# Altium schematic sheet 低频超声第二版a.SchDoc
size A1
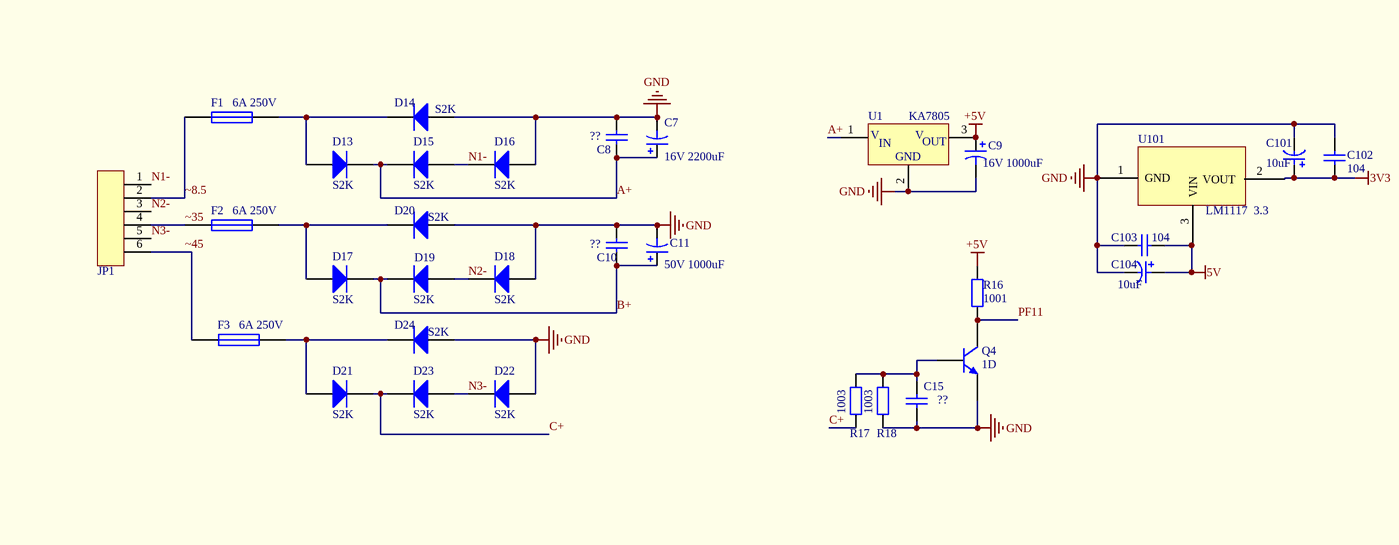
[diagram p0: 低频超声第二版a.SchDoc, top left]
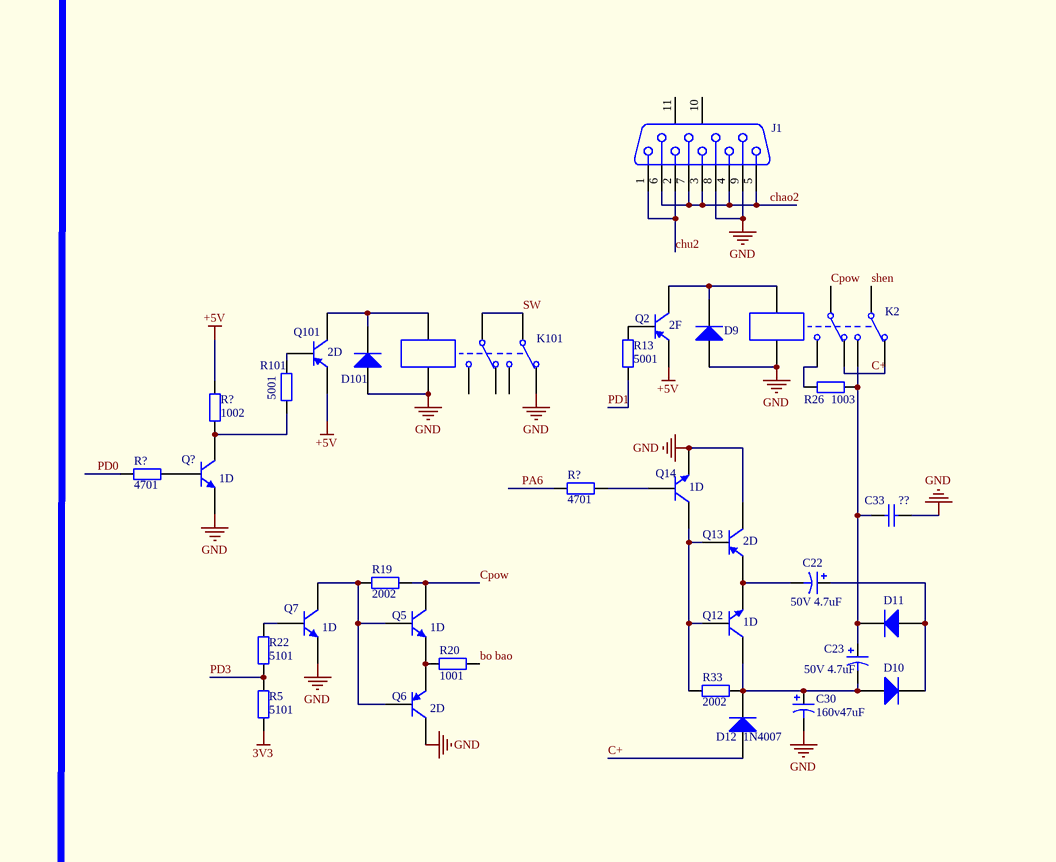
[diagram p1: 低频超声第二版a.SchDoc, top middle]
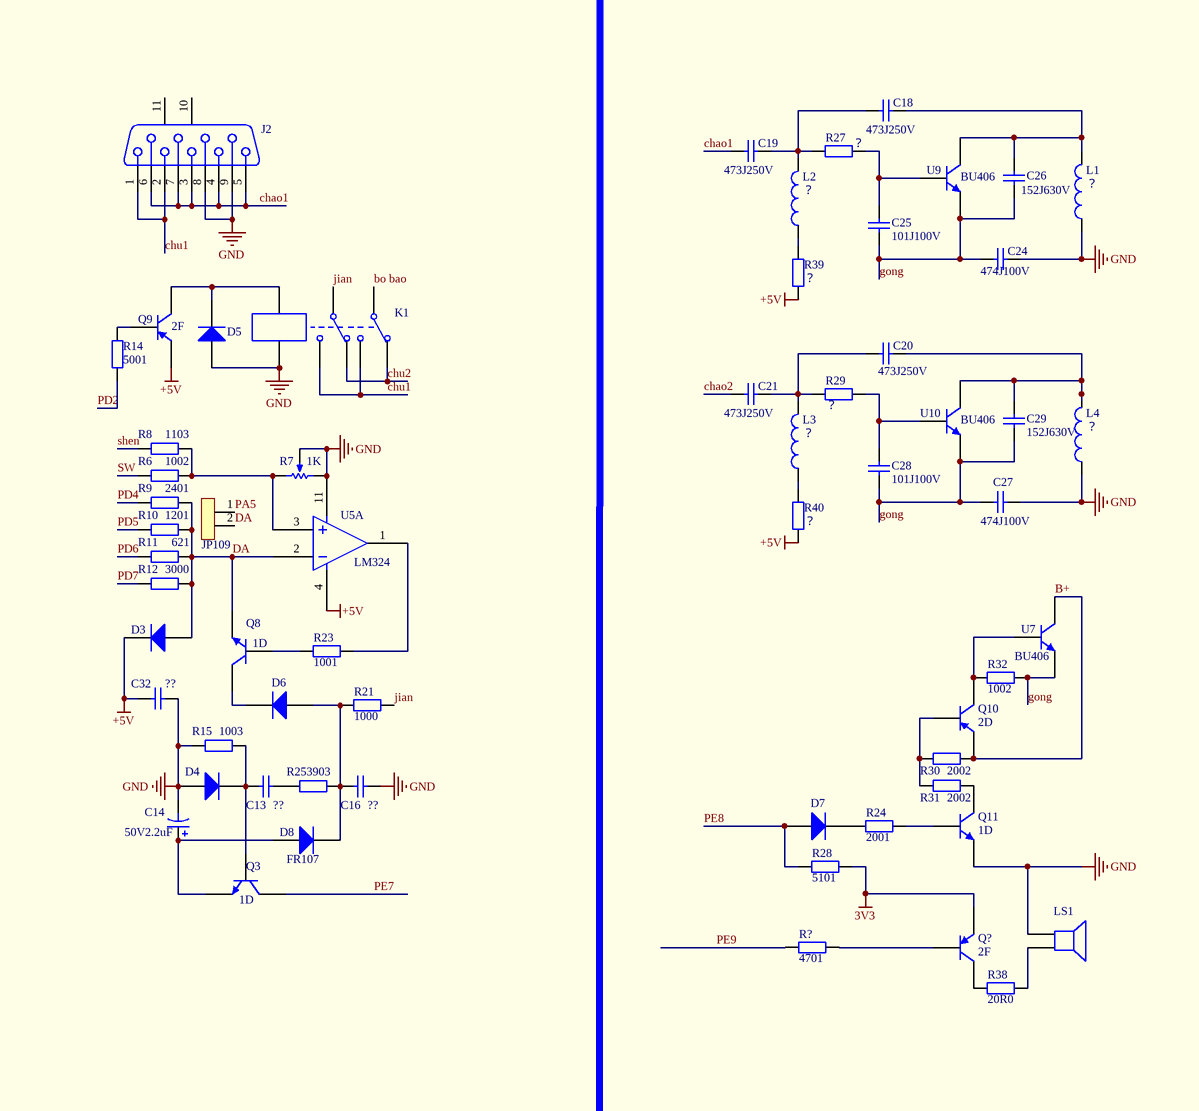
[diagram p2: 低频超声第二版a.SchDoc, top right]
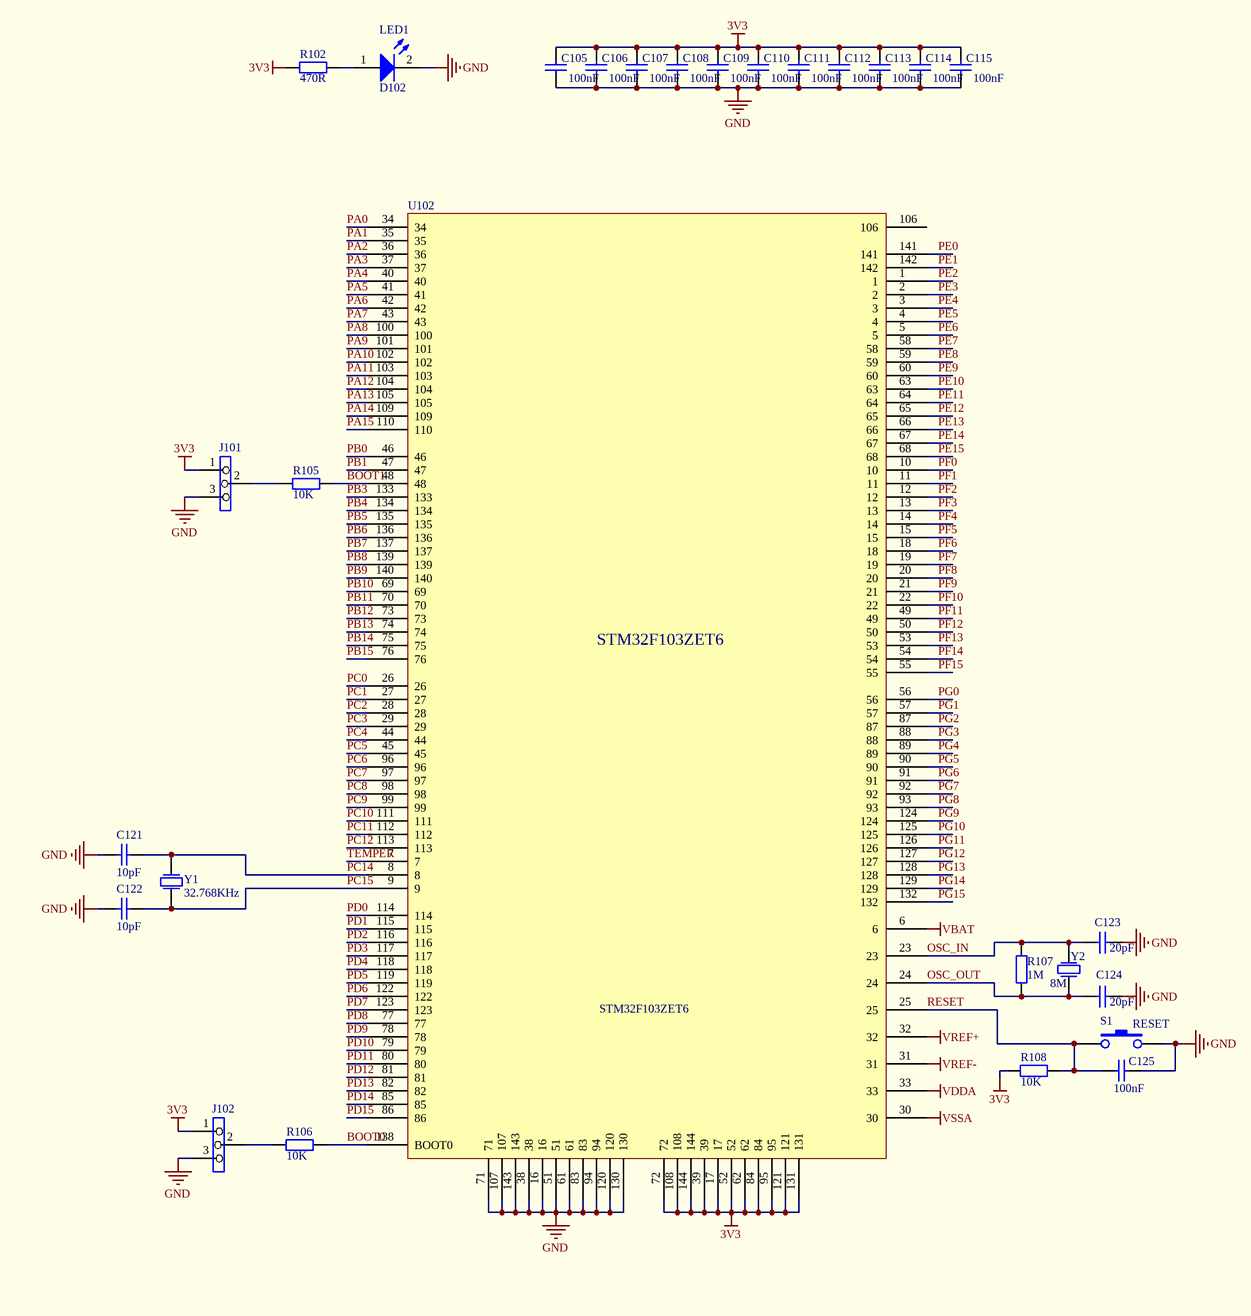
[diagram p3: 低频超声第二版a.SchDoc, bottom left]
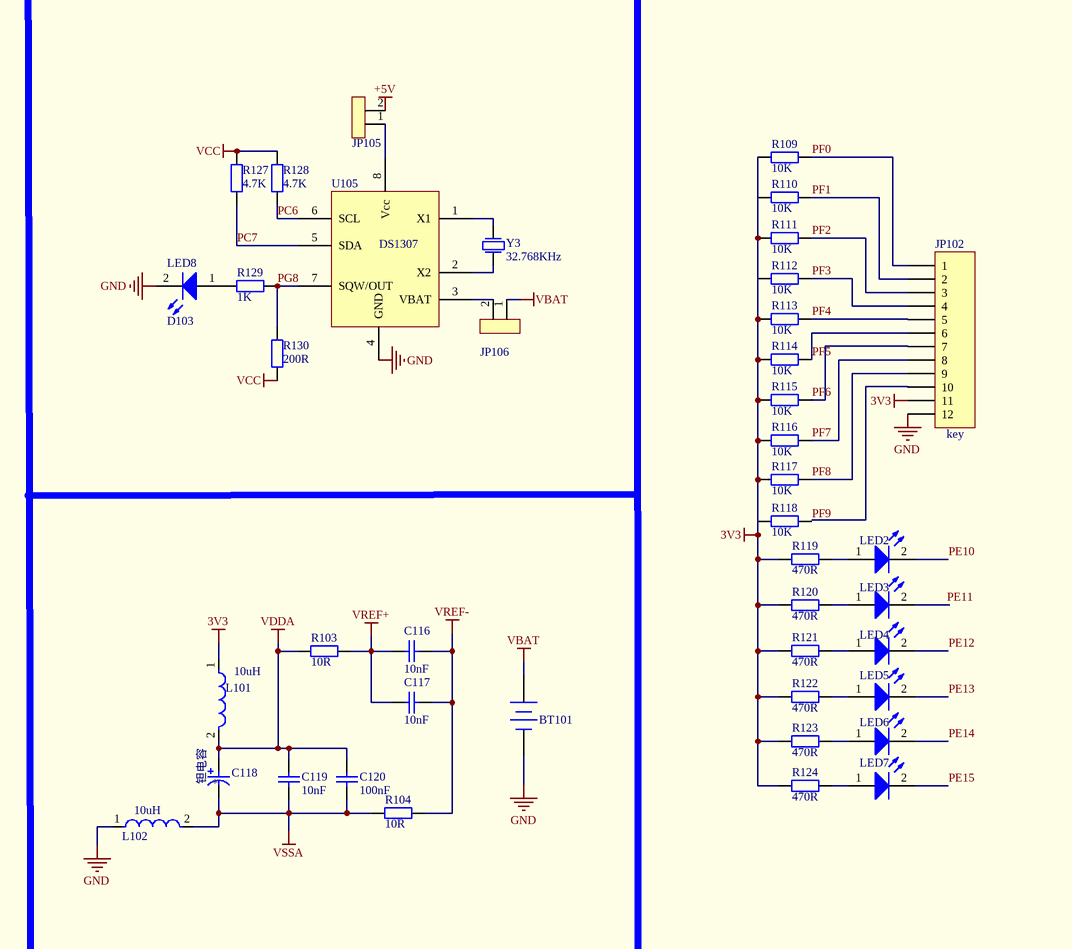
[diagram p4: 低频超声第二版a.SchDoc, bottom middle]
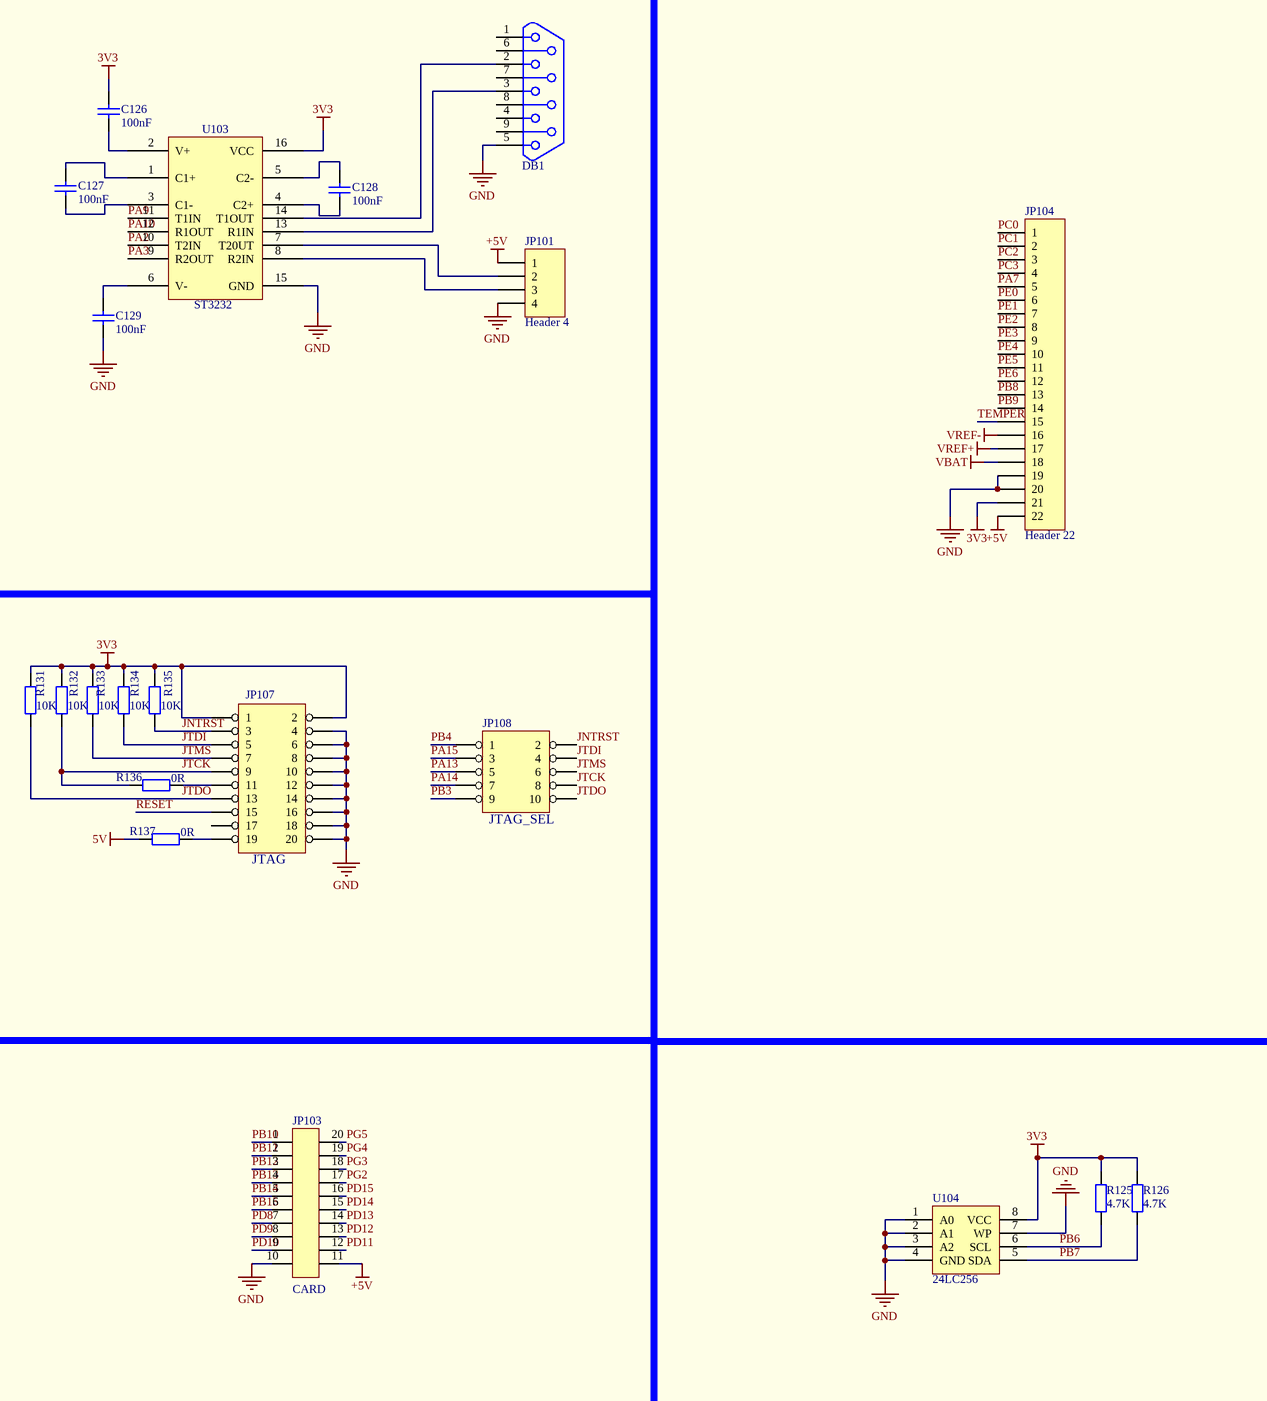
[diagram p5: 低频超声第二版a.SchDoc, bottom right]

## Parts
(Parts that share a designator on the sheet are numbered #1, #2 ... from top to bottom, then left to right.)
BT101  BATTERY  [BAT]  (value not drawn)
C7  16V 2200uF  [RB7.6-15]
C8  ??  [RAD-0.3]
C9  16V 1000uF  [RB7.6-15]
C10  ??  [RAD-0.3]
C11  50V 1000uF  [RB7.6-15]
C13  ??  [RAD-0.3]
C14  value 50V2.2uF  [RB7.6-15]  (hidden comment: Cap Pol1)
C15  value ??  [RAD-0.3]  (hidden comment: Cap)
C16  ??  [RAD-0.3]
C18  value 473J250V  [RAD-0.3]  (hidden comment: Cap)
C19  value 473J250V  [RAD-0.3]  (hidden comment: Cap)
C20  value 473J250V  [RAD-0.3]  (hidden comment: Cap)
C21  value 473J250V  [RAD-0.3]  (hidden comment: Cap)
C22  50V 4.7uF  [RB7.6-15]
C23  50V 4.7uF  [RB7.6-15]
C24  value 474J100V  [RAD-0.3]  (hidden comment: Cap)
C25  value 101J100V  [RAD-0.3]  (hidden comment: Cap)
C26  value 152J630V  [RAD-0.3]  (hidden comment: Cap)
C27  value 474J100V  [RAD-0.3]  (hidden comment: Cap)
C28  value 101J100V  [RAD-0.3]  (hidden comment: Cap)
C29  value 152J630V  [RAD-0.3]  (hidden comment: Cap)
C30  value 160v47uF  [RB7.6-15]  (hidden comment: Cap Pol1)
C32  ??  [RAD-0.3]
C33  ??  [RAD-0.3]
C101  10uF  [钽电容]
C102  104  [0805C]
C103  104  [0805C]
C104  10uF  [钽电容]
C105  100nF  [0805C]
C106  100nF  [0805C]
C107  100nF  [0805C]
C108  100nF  [0805C]
C109  100nF  [0805C]
C110  100nF  [0805C]
C111  100nF  [0805C]
C112  100nF  [0805C]
C113  100nF  [0805C]
C114  100nF  [0805C]
C115  100nF  [0805C]
C116  10nF  [0805C]
C117  10nF  [0805C]
C118  *  [钽电容]
C119  10nF  [0805C]
C120  100nF  [0805C]
C121  10pF  [0805C]
C122  10pF  [0805C]
C123  20pF  [0805C]
C124  20pF  [0805C]
C125  100nF  [0805C]
C126  100nF  [0805C]
C127  100nF  [0805C]
C128  100nF  [0805C]
C129  100nF  [0805C]
D3  Diode  [SMC]  (value not drawn)
D4  Diode  [SMC]  (value not drawn)
D5  Diode  [SMC]  (value not drawn)
D6  Diode  [SMC]  (value not drawn)
D7  Diode  [SMC]  (value not drawn)
D8  FR107  [SMC]
D9  Diode  [SMC]  (value not drawn)
D10  Diode  [SMC]  (value not drawn)
D11  Diode  [SMC]  (value not drawn)
D12  1N4007  [SMC]
D13  S2K  [SMC]
D14  S2K  [SMC]
D15  S2K  [SMC]
D16  S2K  [SMC]
D17  S2K  [SMC]
D18  S2K  [SMC]
D19  S2K  [SMC]
D20  S2K  [SMC]
D21  S2K  [SMC]
D22  S2K  [SMC]
D23  S2K  [SMC]
D24  S2K  [SMC]
D101  Diode  [SMC]  (value not drawn)
D104  LED2  [LED]
D105  LED3  [LED]
D106  LED4  [LED]
D107  LED5  [LED]
D108  LED6  [LED]
D109  LED7  [LED]
DB1  DB9  [DB9]  (value not drawn)
F1  6A 250V  [PIN-W2/E2.8]
F2  6A 250V  [PIN-W2/E2.8]
F3  6A 250V  [PIN-W2/E2.8]
J1  D Connector 9  [DSUB1.385-2H9]  (value not drawn)
J2  D Connector 9  [DSUB1.385-2H9]  (value not drawn)
J101  *  [选择跳线]  (value not drawn)
J102  *  [选择跳线]  (value not drawn)
JP1  6 PIN  [6 PIN]  (value not drawn)
JP101  Header 4  [HDR1X4]
JP102  key  [HDR1X12]
JP103  CARD  [双排插针10x2]
JP104  Header 22  [HDR1X22]
JP105  单排插针2  [单排插针2]  (value not drawn)
JP106  单排插针2  [单排插针2]  (value not drawn)
JP107  JTAG  [JTAG]  (value not drawn)
JP108  5*2  [5*2]  (value not drawn)
JP109  单排插针2  [单排插针2]  (value not drawn)
K1  Relay-DPDT  [DIP-P8]  (value not drawn)
K2  Relay-DPDT  [DIP-P8]  (value not drawn)
K101  Relay-DPDT  [DIP-P8]  (value not drawn)
L1  value ？  [0402-A]  (hidden comment: Inductor)
L2  value ？  [0402-A]  (hidden comment: Inductor)
L3  value ？  [0402-A]  (hidden comment: Inductor)
L4  value ？  [0402-A]  (hidden comment: Inductor)
L101  10uH  [0805R]
L102  10uH  [0805R]
LED1  D102  [LED]
LED8  D103  [LED]
LS1  Speaker  [PIN2]  (value not drawn)
Q2  2F  [TO-92A]
Q3  1D  [TO-92A]
Q4  1D  [TO-92A]
Q5  1D  [TO-92A]
Q6  2D  [TO-92A]
Q7  1D  [TO-92A]
Q8  1D  [TO-92A]
Q9  2F  [TO-92A]
Q10  2D  [TO-92A]
Q11  1D  [TO-92A]
Q12  1D  [TO-92A]
Q13  2D  [TO-92A]
Q14  1D  [TO-92A]
Q101  2D  [TO-92A]
Q?#1  1D  [TO-92A]
Q?#2  2F  [TO-92A]
R5  value 5101  [AXIAL-0.4]  (hidden comment: Res2)
R6  value 1002  [AXIAL-0.4]  (hidden comment: Res2)
R7  value 1K  [VR5]  (hidden comment: RPot)
R8  value 1103  [AXIAL-0.4]  (hidden comment: Res2)
R9  value 2401  [AXIAL-0.4]  (hidden comment: Res2)
R10  value 1201  [AXIAL-0.4]  (hidden comment: Res2)
R11  value 621  [AXIAL-0.4]  (hidden comment: Res2)
R12  value 3000  [AXIAL-0.4]  (hidden comment: Res2)
R13  value 5001  [AXIAL-0.4]  (hidden comment: Res2)
R14  value 5001  [AXIAL-0.4]  (hidden comment: Res2)
R15  value 1003  [AXIAL-0.4]  (hidden comment: Res2)
R16  value 1001  [AXIAL-0.4]  (hidden comment: Res2)
R17  value 1003  [AXIAL-0.4]  (hidden comment: Res2)
R18  value 1003  [AXIAL-0.4]  (hidden comment: Res2)
R19  value 2002  [AXIAL-0.4]  (hidden comment: Res2)
R20  1001  [AXIAL-0.4]
R21  value 1000  [AXIAL-0.4]  (hidden comment: Res2)
R22  value 5101  [AXIAL-0.4]  (hidden comment: Res2)
R23  value 1001  [AXIAL-0.4]  (hidden comment: Res2)
R24  value 2001  [AXIAL-0.4]  (hidden comment: Res2)
R25  value 3903  [AXIAL-0.4]  (hidden comment: Res2)
R26  value 1003  [AXIAL-0.4]  (hidden comment: Res2)
R27  value ？  [AXIAL-0.4]  (hidden comment: Res2)
R28  value 5101  [AXIAL-0.4]  (hidden comment: Res2)
R29  value ？  [AXIAL-0.4]  (hidden comment: Res2)
R30  value 2002  [AXIAL-0.4]  (hidden comment: Res2)
R31  value 2002  [AXIAL-0.4]  (hidden comment: Res2)
R32  value 1002  [AXIAL-0.4]  (hidden comment: Res2)
R33  value 2002  [AXIAL-0.4]  (hidden comment: Res2)
R38  value 20R0  [AXIAL-0.4]  (hidden comment: Res2)
R39  value ？  [AXIAL-0.4]  (hidden comment: Res2)
R40  value ？  [AXIAL-0.4]  (hidden comment: Res2)
R101  value 5001  [AXIAL-0.4]  (hidden comment: Res2)
R102  470R  [0805R]
R103  10R  [0805R]
R104  10R  [0805R]
R105  10K  [0805R]
R106  10K  [0805R]
R107  1M  [0805R]
R108  10K  [0805R]
R109  10K  [0805R]
R110  10K  [0805R]
R111  10K  [0805R]
R112  10K  [0805R]
R113  10K  [0805R]
R114  10K  [0805R]
R115  10K  [0805R]
R116  10K  [0805R]
R117  10K  [0805R]
R118  10K  [0805R]
R119  470R  [0805R]
R120  470R  [0805R]
R121  470R  [0805R]
R122  470R  [0805R]
R123  470R  [0805R]
R124  470R  [0805R]
R125  4.7K  [0805R]
R126  4.7K  [0805R]
R127  4.7K  [0805R]
R128  4.7K  [0805R]
R129  1K  [0805R]
R130  200R  [0805R]
R131  10K  [0805R]
R132  10K  [0805R]
R133  10K  [0805R]
R134  10K  [0805R]
R135  10K  [0805R]
R136  0R  [0805R]
R137  0R  [0805R]
R?#1  value 1002  [AXIAL-0.4]  (hidden comment: Res2)
R?#2  value 4701  [AXIAL-0.4]  (hidden comment: Res2)
R?#3  value 4701  [AXIAL-0.4]  (hidden comment: Res2)
R?#4  value 4701  [AXIAL-0.4]  (hidden comment: Res2)
S1  RESET  [按键]
U1  KA7805  [78XX]
U5  LM324  [LM324]  (part A of 4)
U7  BU406  [TO-92A]
U9  BU406  [TO-92A]
U10  BU406  [TO-92A]
U101  LM1117  3.3  [LM1117]
U102  STM32F103ZET6  [STM32F103ZET6_1]
U103  ST3232  [ST2323]
U104  24LC256  [24C02]
U105  DS1307
Y1  32.768KHz  [32.768KHz]
Y2  8M  [晶振]
Y3  32.768KHz  [32.768KHz]

## Nets
3V3: C101.1 C102.2 C105.2 C106.2 C107.2 C108.2 C109.2 C110.1 C111.1 C112.1 C113.1 C114.1 C115.1 C126.2 J101.1 J102.1 JP102.11 JP104.21 JP107.1 JP107.2 L101.1(Pri+) Q?#2.1(E) R5.2 R28.1 R102.2 R108.2 R109.2 R110.2 R111.2 R112.2 R113.2 R114.2 R115.2 R116.2 R117.2 R118.2 R119.1 R120.1 R121.1 R122.1 R123.1 R124.1 R125.2 R126.2 R131.1 R132.1 R133.1 R134.1 R135.1 U101.2(VOUT) U102.17 U102.39 U102.52 U102.62 U102.72 U102.84 U102.95 U102.108 U102.121 U102.131 U102.144 U103.16(VCC) U104.8(VCC)
5V: C103.2 C104.1 R137.1 U101.3(VIN)
+5V: C9.1 C32.2 D3.2(K) JP101.1 JP103.11 JP104.22 JP105.2 Q2.1(E) Q9.1(E) Q101.1(E) R16.2 R39.1 R40.1 R?#1.1 U1.3(VOUT) U5.4(VCC)
GND: BT101.2(-) C7.2 C8.1 C9.2 C10.1 C11.2 C14.2 C15.1 C16.1 C24.2 C27.2 C30.2 C32.1 C33.1 C101.2 C102.1 C103.1 C104.2 C105.1 C106.1 C107.1 C108.1 C109.1 C110.2 C111.2 C112.2 C113.2 C114.2 C115.2 C121.2 C122.2 C123.2 C124.2 C125.2 C129.1 D4.1(A) D5.1(A) D9.1(A) D14.1(A) D16.1(A) D18.1(A) D20.1(A) D22.1(A) D24.1(A) D101.1(A) DB1.5 J1.8 J1.9 J2.8 J2.9 J101.3 J102.3 JP101.4 JP102.12 JP103.10 JP104.19 JP104.20 JP107.4 JP107.6 JP107.8 JP107.10 JP107.12 JP107.14 JP107.16 JP107.18 JP107.20 K1.8 K2.8 K101.2 K101.8 L1.1 L4.1 L102.1(Pri+) LED1.2(K) LED8.2(K) LS1.1 Q4.1(E) Q6.3(C) Q7.1(E) Q11.1(E) Q13.3(C) Q14.1(E) Q?#1.1(E) R7.1(TOP) R7.3(TAP) R15.1 R18.1 S1.2 U1.2(GND) U5.11(GND) U101.1(GND) U102.16 U102.38 U102.51 U102.61 U102.71 U102.83 U102.94 U102.107 U102.120 U102.130 U102.143 U103.15(GND) U104.1(A0) U104.2(A1) U104.3(A2) U104.4(GND) U104.7(WP) U105.4(GND)
VBAT: BT101.1(+) JP104.18 JP106.1 U102.6
VCC: R127.2 R128.2 R130.2
VDDA: C118.1 C119.1 C120.1 L101.2(Pri-) R103.2 U102.33
VREF+: C116.1 C117.1 JP104.17 R103.1 U102.32
VREF-: C116.2 C117.2 JP104.16 R104.1 U102.31
VSSA: C118.2 C119.2 C120.2 L102.2(Pri-) R104.2 U102.30
A+: C7.1 C8.2 D13.2(K) D15.2(K) U1.1(VIN)
B+: C10.2 C11.1 D17.2(K) D19.2(K) Q10.1(E) R30.2 U7.3(C)
bo bao: K1.1 R20.1
BOOT0: R106.1 U102.138(BOOT0)
BOOT1: R105.1 U102.48
C+: D12.1(A) D21.2(K) D23.2(K) K2.2 K2.5 R17.1
chao1: C19.1 J2.3 J2.4 J2.5 J2.6 J2.7
chao2: C21.1 J1.3 J1.4 J1.5 J1.6 J1.7
chu1: J2.1 J2.2 K1.3 K1.6
chu2: J1.1 J1.2 K1.2 K1.5
Cpow: K2.4 Q5.3(C) R19.1
DA: D3.1(A) JP109.2 Q8.1(E) R9.2 R10.2 R11.2 R12.2 U5.2
gong: C24.1 C25.1 C26.2 C27.1 C28.1 C29.2 R32.1 U7.1(E) U9.1(E) U10.1(E)
jian: K1.4 R21.2
JNTRST: JP107.3 JP108.2 R135.2
JTCK: JP107.9 JP108.8 R132.2 R136.1
JTDI: JP107.5 JP108.4 R134.2
JTDO: JP107.13 JP108.10 R131.2
JTMS: JP107.7 JP108.6 R133.2
N1-: D15.1(A) D16.2(K) JP1.1
N2-: D18.2(K) D19.1(A) JP1.3
N3-: D22.2(K) D23.1(A) JP1.5
OSC_IN: C123.1 R107.2 U102.23 Y2.1(P1)
OSC_OUT: C124.1 R107.1 U102.24 Y2.2(P2)
PA0: U102.34
PA1: U102.35
PA2: U102.36 U103.10(T2IN)
PA3: U102.37 U103.9(R2OUT)
PA4: U102.40
PA5: JP109.1 U102.41
PA6: R?#3.2 U102.42
PA7: JP104.5 U102.43
PA8: U102.100
PA9: U102.101 U103.11(T1IN)
PA10: U102.102 U103.12(R1OUT)
PA11: U102.103
PA12: U102.104
PA13: JP108.5 U102.105
PA14: JP108.7 U102.109
PA15: JP108.3 U102.110
PB0: U102.46
PB1: U102.47
PB3: JP108.9 U102.133
PB4: JP108.1 U102.134
PB5: U102.135
PB6: R125.1 U102.136 U104.6(SCL)
PB7: R126.1 U102.137 U104.5(SDA)
PB8: JP104.13 U102.139
PB9: JP104.14 U102.140
PB10: JP103.1 U102.69
PB11: JP103.2 U102.70
PB12: JP103.3 U102.73
PB13: JP103.4 U102.74
PB14: JP103.5 U102.75
PB15: JP103.6 U102.76
PC0: JP104.1 U102.26
PC1: JP104.2 U102.27
PC2: JP104.3 U102.28
PC3: JP104.4 U102.29
PC4: U102.44
PC5: U102.45
PC6: R128.1 U102.96 U105.6(SCL)
PC7: R127.1 U102.97 U105.5(SDA)
PC8: U102.98
PC9: U102.99
PC10: U102.111
PC11: U102.112
PC12: U102.113
PC14: C121.1 U102.8 Y1.2(P2)
PC15: C122.1 U102.9 Y1.1(P1)
PD0: R?#2.2 U102.114
PD1: R13.2 U102.115
PD2: R14.2 U102.116
PD3: R5.1 R22.2 U102.117
PD4: R9.1 U102.118
PD5: R10.1 U102.119
PD6: R11.1 U102.122
PD7: R12.1 U102.123
PD8: JP103.7 U102.77
PD9: JP103.8 U102.78
PD10: JP103.9 U102.79
PD11: JP103.12 U102.80
PD12: JP103.13 U102.81
PD13: JP103.14 U102.82
PD14: JP103.15 U102.85
PD15: JP103.16 U102.86
PE0: JP104.6 U102.141
PE1: JP104.7 U102.142
PE2: JP104.8 U102.1
PE3: JP104.9 U102.2
PE4: JP104.10 U102.3
PE5: JP104.11 U102.4
PE6: JP104.12 U102.5
PE7: Q3.3(C) U102.58
PE8: D7.1(A) R28.2 U102.59
PE9: R?#4.2 U102.60
PE10: D104.2(K) U102.63
PE11: D105.2(K) U102.64
PE12: D106.2(K) U102.65
PE13: D107.2(K) U102.66
PE14: D108.2(K) U102.67
PE15: D109.2(K) U102.68
PF0: JP102.1 R109.1 U102.10
PF1: JP102.2 R110.1 U102.11
PF2: JP102.3 R111.1 U102.12
PF3: JP102.4 R112.1 U102.13
PF4: JP102.5 R113.1 U102.14
PF5: JP102.6 R114.1 U102.15
PF6: JP102.7 R115.1 U102.18
PF7: JP102.8 R116.1 U102.19
PF8: JP102.9 R117.1 U102.20
PF9: R118.1 U102.21
PF10: U102.22
PF11: Q4.3(C) R16.1 U102.49
PF12: U102.50
PF13: U102.53
PF14: U102.54
PF15: U102.55
PG0: U102.56
PG1: U102.57
PG2: JP103.17 U102.87
PG3: JP103.18 U102.88
PG4: JP103.19 U102.89
PG5: JP103.20 U102.90
PG6: U102.91
PG7: U102.92
PG8: R129.1 R130.1 U102.93 U105.7(SQW/OUT)
PG9: U102.124
PG10: U102.125
PG11: U102.126
PG12: U102.127
PG13: U102.128
PG14: U102.129
PG15: U102.132
RESET: C125.1 JP107.15 R108.1 S1.1 U102.25
shen: K2.1 R8.1
SW: K101.1 K101.4 R6.1
TEMPER: JP104.15 U102.7
~8.5: F1.1 JP1.2
~35: F2.1 JP1.4
~45: F3.1 JP1.6
NetC13_1: C13.1 R25.1
NetC13_2: C13.2 D4.2(K) Q3.2(B) R15.2
NetC14_1: C14.1 D8.1(A) Q3.1(E)
NetC15_2: C15.2 Q4.2(B) R17.2 R18.2
NetC16_2: C16.2 D6.1(A) D8.2(K) R21.1 R25.2
NetC18_1: C18.1 C19.2 L2.2 R27.2
NetC18_2: C18.2 C26.1 L1.2 U9.3(C)
NetC20_1: C20.1 C21.2 L3.2 R29.2
NetC20_2: C20.2 C29.1 L4.2 U10.3(C)
NetC22_1: C22.1 D10.2(K) D11.1(A)
NetC22_2: C22.2 Q12.1(E) Q13.1(E)
NetC23_1: C23.1 C33.2 D11.2(K) K2.3 R26.1
NetC23_2: C23.2 C30.1 D10.1(A) D12.2(K) Q12.3(C) R33.2
NetC25_2: C25.2 R27.1 U9.2(B)
NetC28_2: C28.2 R29.1 U10.2(B)
NetC126_1: C126.1 U103.2(V+)
NetC127_1: C127.1 U103.3(C1-)
NetC127_2: C127.2 U103.1(C1+)
NetC128_1: C128.1 U103.4(C2+)
NetC128_2: C128.2 U103.5(C2-)
NetC129_2: C129.2 U103.6(V-)
NetD5_2: D5.2(K) K1.7 Q9.3(C)
NetD6_2: D6.2(K) Q8.3(C)
NetD7_2: D7.2(K) R24.2
NetD9_2: D9.2(K) K2.7 Q2.3(C)
NetD13_1: D13.1(A) D14.2(K) F1.2
NetD17_1: D17.1(A) D20.2(K) F2.2
NetD21_1: D21.1(A) D24.2(K) F3.2
NetD101_2: D101.2(K) K101.7 Q101.3(C)
NetD104_1: D104.1(A) R119.2
NetD105_1: D105.1(A) R120.2
NetD106_1: D106.1(A) R121.2
NetD107_1: D107.1(A) R122.2
NetD108_1: D108.1(A) R123.2
NetD109_1: D109.1(A) R124.2
NetDB1_2: DB1.2 U103.14(T1OUT)
NetDB1_3: DB1.3 U103.13(R1IN)
NetJ101_2: J101.2 R105.2
NetJ102_2: J102.2 R106.2
NetJP101_2: JP101.2 U103.7(T20UT)
NetJP101_3: JP101.3 U103.8(R2IN)
NetJP105_1: JP105.1 U105.8(Vcc)
NetJP106_2: JP106.2 U105.3(VBAT)
NetJP107_11: JP107.11 R136.2
NetJP107_19: JP107.19 R137.2
NetK2_6: K2.6 R26.2
NetL2_1: L2.1 R39.2
NetL3_1: L3.1 R40.2
NetLED1_1: LED1.1(A) R102.1
NetLED8_1: LED8.1(A) R129.2
NetLS1_2: LS1.2 R38.1
NetQ2_2: Q2.2(B) R13.1
NetQ5_1: Q5.1(E) Q6.1(E) R20.2
NetQ5_2: Q5.2(B) Q6.2(B) Q7.3(C) R19.2
NetQ7_2: Q7.2(B) R22.1
NetQ8_2: Q8.2(B) R23.1
NetQ9_2: Q9.2(B) R14.1
NetQ10_2: Q10.2(B) R30.1 R31.1
NetQ10_3: Q10.3(C) R32.2 U7.2(B)
NetQ11_2: Q11.2(B) R24.1
NetQ11_3: Q11.3(C) R31.2
NetQ12_2: Q12.2(B) Q13.2(B) Q14.3(C) R33.1
NetQ14_2: Q14.2(B) R?#3.1
NetQ101_2: Q101.2(B) R101.1
NetQ?#1_2: Q?#1.2(B) R?#2.1
NetQ?#1_3: Q?#1.3(C) R101.2 R?#1.2
NetQ?#2_2: Q?#2.2(B) R?#4.1
NetQ?#2_3: Q?#2.3(C) R38.2
NetR6_2: R6.2 R7.2(BOT) R8.2 U5.3
NetR23_2: R23.2 U5.1
NetU105_1: U105.1(X1) Y3.2(P2)
NetU105_2: U105.2(X2) Y3.1(P1)

Not connected (* = marked no-connect by the designer): DB1 1 4 6 7 8 9; J1 10(MH1) 11(MH2); J2 10(MH1) 11(MH2); JP102 10; JP107 17; K101 3 5 6; U102 106

## Notes on the sheet
- (in symbol 5*2) JTAG_SEL
- (in symbol 78L) V; OUT; IN

## Library data of the parts
BT101 = BATT
C7 C9 C11 C22 = Cap Pol1: Polarized Capacitor (Radial); Value: 100pF; Published: 8-Jun-2000; LatestRevisionDate: 17-Jul-2002; LatestRevisionNote: Re-released for DXP Platform.; PackageReference: RB7.6-15; Publisher: Altium Limited; PackageDescription: Polarized Capacitor (Radial); 2 Leads
C8 C10 = Cap: Capacitor; Value: 100pF; Published: 8-Jun-2000; LatestRevisionDate: 17-Jul-2002; LatestRevisionNote: Re-released for DXP Platform.; PackageReference: RAD-0.3; Publisher: Altium Limited; PackageDescription: Radial Cap, Thru-Hole; 2 Leads; 0.3 in Pin Spacing
C13 C15 C16 C18-C21 C24-C29 C32 C33 = Cap: Capacitor; Published: 8-Jun-2000; LatestRevisionDate: 17-Jul-2002; LatestRevisionNote: Re-released for DXP Platform.; PackageReference: RAD-0.3; Publisher: Altium Limited; PackageDescription: Radial Cap, Thru-Hole; 2 Leads; 0.3 in Pin Spacing
  C13 C16 C32 C33: Value: ?
C14 C23 C30 = Cap Pol1: Polarized Capacitor (Radial); Published: 8-Jun-2000; LatestRevisionDate: 17-Jul-2002; LatestRevisionNote: Re-released for DXP Platform.; PackageReference: RB7.6-15; Publisher: Altium Limited; PackageDescription: Polarized Capacitor (Radial); 2 Leads
  C23: Value: 50V4.7uF
C101 C104 C118 = 钽电容
C102 C103 C105-C117 C119-C129 = 电容
D3-D24 D101 = Diode: Default Diode; Published: 8-Jun-2000; LatestRevisionDate: 17-Jul-2002; LatestRevisionNote: Re-released for DXP Platform.; PackageVersion: Sep-1996; PackageReference: SMC; Publisher: Altium Limited; PackageDescription: DO-214-AB/SMC; 2 C-Bend Leads; Body 7.9 x 5.9 mm, inc. leads (LxW); Code_JEDEC: DO-214-AB
D104-D109 LED1 LED8 = LED
DB1 = DB
F1-F3 = Fuse 1: Fuse; Published: 8-Jun-2000; LatestRevisionDate: 17-Jul-2002; LatestRevisionNote: Re-released for DXP Platform.; PackageReference: PIN-W2/E2.8; Publisher: Altium Limited; PackageDescription: Thru-Hole; 2 Leads
J1 J2 = D Connector 9: Receptacle Assembly, 9 Position, Right Angle; PackageDocument: O; Positions: 9; Published: 15-Jun-2001; LatestRevisionDate: 17-Jul-2002; LatestRevisionNote: Re-released for DXP Platform.; DatasheetDocument: 1-Sep-1999; PackageReference: 788750; Publisher: Altium Limited; Orientation: Right Angle; Gender: Receptacle
J101 J102 = 选择跳线
JP101 = Header 4: Header, 4-Pin; LatestRevisionDate: 17-Jul-2002; LatestRevisionNote: Re-released for DXP Platform.; Publisher: Altium Limited
JP102 = Header 12: Header, 12-Pin; LatestRevisionDate: 17-Jul-2002; LatestRevisionNote: Re-released for DXP Platform.; Publisher: Altium Limited
JP103 = ?
JP104 = Header 22: Header, 22-Pin; LatestRevisionDate: 17-Jul-2002; LatestRevisionNote: Re-released for DXP Platform.; Publisher: Altium Limited
K1 K2 K101 = Relay-DPDT: Dual-Pole Dual-Throw Relay; Published: 24-Mar-1999; LatestRevisionDate: 17-Jul-2002; LatestRevisionNote: Re-released for DXP Platform.; PackageReference: DIP-P8; Publisher: Altium Limited; PackageDescription: Relay; 8 Leads
L1-L4 = Inductor: Code_IEC: 1005; Published: 8-Jun-2000; LatestRevisionDate: 29-May-2009; LatestRevisionNote: IPC-7351 Footprint Added.; PackageReference: 0402-A; Publisher: Altium Limited; PackageDescription: Chip Inductor; Code_JEITA: 0402
L101 L102 = 电感
LS1 = Speaker: Loudspeaker; Published: 24-Mar-1999; LatestRevisionDate: 17-Jul-2002; LatestRevisionNote: Re-released for DXP Platform.; PackageReference: PIN2; Publisher: Altium Limited
Q2 Q6 Q9 Q10 Q13 Q101 Q?#2 = 2N3906: PNP General Purpose Amplifier; Published: 8-Jun-2000; LatestRevisionDate: 15-Jan-2003; LatestRevisionNote: PCB Footprint 'BCY-W3/D4.7' replaced; DatasheetVersion: 1997; PackageVersion: Sep-1998; PackageReference: TO-92A; Publisher: Altium Limited; PackageDescription: TO, Flat Index; 3 In-Line, Axial Leads; Body Dia. 4.5mm; Leads 0.51 x 0.48 mm (max); ComponentLink1Description: Manufacturer Link; ComponentLink1URL: http://www.fairchildsemi.com/; ComponentLink2Description: Datasheet; ComponentLink2URL: http://www.fairchildsemi.com/ds/2N%2F2N3906.pdf
Q3-Q5 Q7 Q8 Q11 Q12 Q14 Q?#1 U7 U9 U10 = 2N3904: NPN General Purpose Amplifier; Published: 8-Jun-2000; LatestRevisionDate: 15-Jan-2003; LatestRevisionNote: PCB Footprint 'BCY-W3/D4.7' replaced; DatasheetVersion: 1997; PackageVersion: Sep-1998; PackageReference: TO-92A; Publisher: Altium Limited; PackageDescription: TO, Flat Index; 3 In-Line, Axial Leads; Body Dia. 4.5mm; Leads 0.51 x 0.48 mm (max); ComponentLink1Description: Manufacturer Link; ComponentLink1URL: http://www.fairchildsemi.com/; ComponentLink2Description: Datasheet; ComponentLink2URL: http://www.fairchildsemi.com/ds/2N%2F2N3904.pdf
R5 R6 R8-R19 R21-R33 R38-R40 R101 R?#1-R?#4 = Res2: Resistor; Published: 8-Jun-2000; LatestRevisionDate: 17-Jul-2002; LatestRevisionNote: Re-released for DXP Platform.; PackageReference: AXIAL-0.4; Publisher: Altium Limited; PackageDescription: Axial Device, Thru-Hole; 2 Leads; 0.4 in Pin Spacing
R7 = RPot: Potentiometer; Sim Note: Enter the Resistance value and the set point into parameter fields.; Set Position: 0.5; Published: 8-Jun-2000; LatestRevisionDate: 17-Jul-2002; LatestRevisionNote: Re-released for DXP Platform.; PackageReference: VR5; Publisher: Altium Limited; PackageDescription: Variable Resistor, Thru-Hole; 3 Leads
R20 = Res2: Resistor; Value: 1K; Published: 8-Jun-2000; LatestRevisionDate: 17-Jul-2002; LatestRevisionNote: Re-released for DXP Platform.; PackageReference: AXIAL-0.4; Publisher: Altium Limited; PackageDescription: Axial Device, Thru-Hole; 2 Leads; 0.4 in Pin Spacing
R102-R137 = 电阻
S1 = 按键
U1 = 78L: 3-Terminal Positive Voltage Regulator
U5 = L
U101 = 1117
U102 = STM32
U103 = ST
U104 = 24C02
U105 = DS1
Y1 Y3 = 32.768KH
Y2 = 晶振